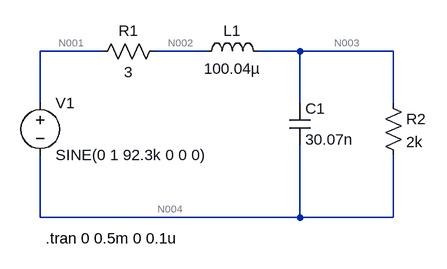
[diagram p0: schematic rim2025-01u.asc]
rim2025-01u.asc, the LTspice schematic file:
Version 4.1
SHEET 1 880 680
WIRE 208 32 112 32
WIRE 368 32 288 32
WIRE 512 32 448 32
WIRE 656 32 512 32
WIRE 112 112 112 32
WIRE 512 112 512 32
WIRE 656 112 656 32
WIRE 112 288 112 192
WIRE 512 288 512 176
WIRE 512 288 112 288
WIRE 656 288 656 192
WIRE 656 288 512 288
SYMBOL voltage 112 96 R0
WINDOW 123 0 0 Left 0
WINDOW 39 0 0 Left 0
SYMATTR InstName V1
SYMATTR Value SINE(0 1 92.3k 0 0 0)
SYMBOL res 304 16 R90
WINDOW 0 0 56 VBottom 2
WINDOW 3 32 56 VTop 2
SYMATTR InstName R1
SYMATTR Value 3
SYMBOL ind 352 48 R270
WINDOW 0 32 56 VTop 2
WINDOW 3 5 56 VBottom 2
SYMATTR InstName L1
SYMATTR Value 100.04µ
SYMATTR SpiceLine Rser=1m
SYMBOL cap 496 112 R0
SYMATTR InstName C1
SYMATTR Value 30.07n
SYMBOL res 640 96 R0
SYMATTR InstName R2
SYMATTR Value 2k
TEXT 120 320 Left 2 !.tran 0 0.5m 0 0.1u

The netlist it stands for:
* rim2025-01u.asc
V1 N001 N004 SINE(0 1 92.3k 0 0 0)
R1 N002 N001 3
L1 N002 N003 100.04µ Rser=1m
C1 N003 N004 30.07n
R2 N003 N004 2k
.tran 0 0.5m 0 0.1u
.backanno
.end

* Results of the author's LTspice run, read from the files saved beside the schematic
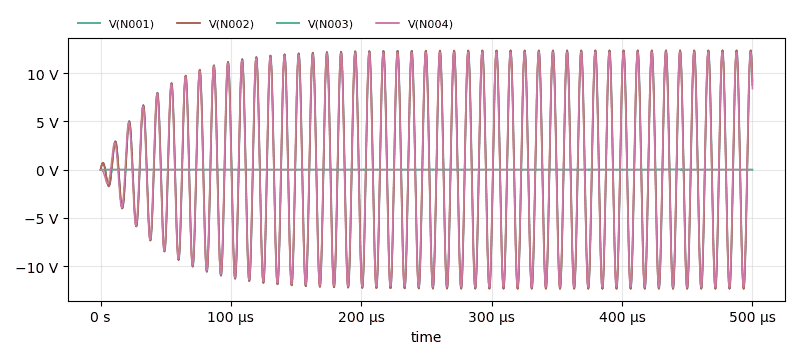
[diagram p1: Transient Analysis of rim2025-01u.asc, plotted from the saved traces]
* Transient Analysis, 1 run:
*   V(N001): min -12.35 V, max 12.35 V, average 28.41 mV, rms 8.175 V, last 9.199 V
*   V(N002): min -12.33 V, max 12.33 V, average 29.97 mV, rms 8.163 V, last 8.75 V
*   V(N003): min -13 mV, max 12.26 mV, average 2.617 µV, rms 640.6 µV, last 509 µV
*   V(N004): min -12.18 V, max 12.18 V, average 26.99 mV, rms 8.066 V, last 8.39 V